# Altium schematic sheet qol56-top.SchDoc
size 297 x 210 mm
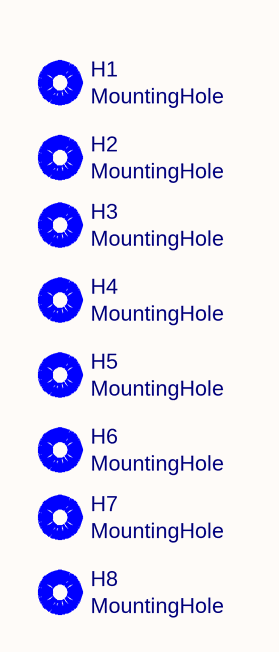
[diagram p0: qol56-top.SchDoc]

## Parts
H1  MountingHole  [MountingHole_2.2mm_M2]
H2  MountingHole  [MountingHole_2.2mm_M2]
H3  MountingHole  [MountingHole_2.2mm_M2]
H4  MountingHole  [MountingHole_2.2mm_M2]
H5  MountingHole  [MountingHole_2.2mm_M2]
H6  MountingHole  [MountingHole_2.2mm_M2]
H7  MountingHole  [MountingHole_2.2mm_M2]
H8  MountingHole  [MountingHole_2.2mm_M2]

## Notes on the sheet
- 1
- 2
- 3
- 4
- 5
- 6
- A
- B
- C
- D
- Title:
- File: qol56-top.sch
- Sheet: /
- KiCad E.D.A.  kicad (5.1.4)-1
- Size: A4
- Date:
- Rev:
- Id: 1/1

## Library data of the parts
H1-H8 = MountingHole: Value: MountingHole; Footprint: MountingHole:MountingHole_2.2mm_M2